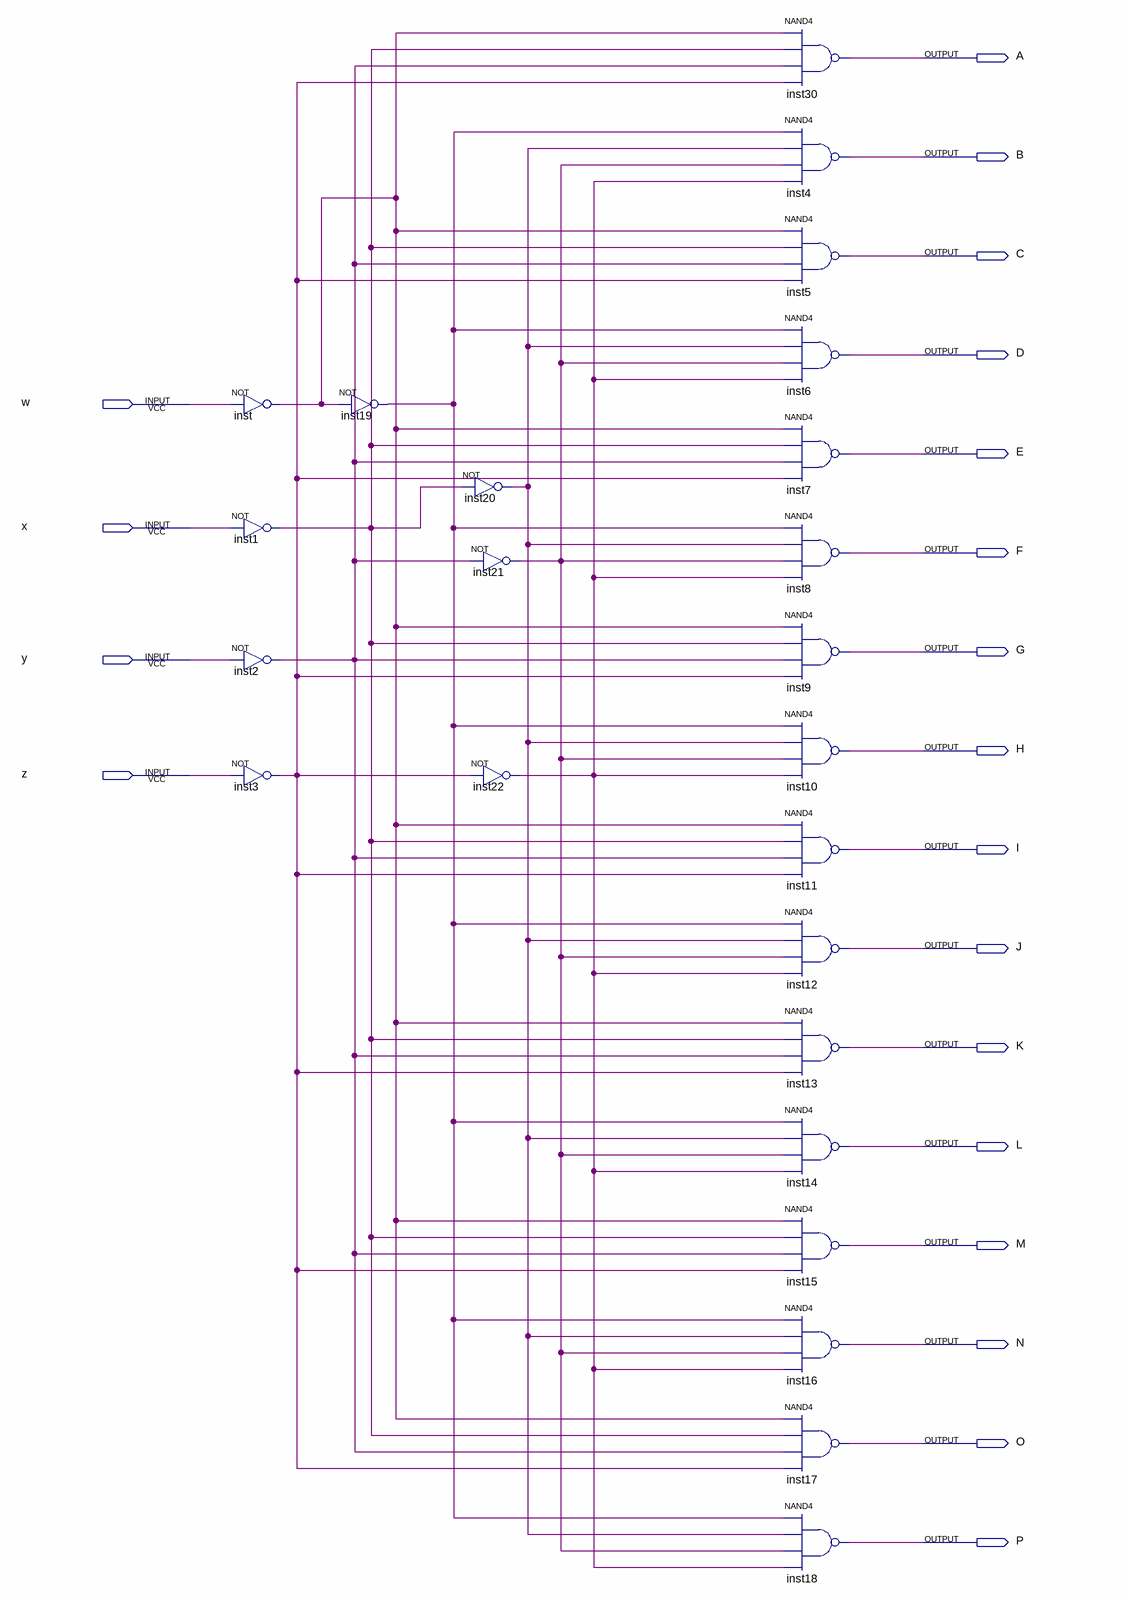
[diagram p0: schematic sheet]
// Quartus schematic decoder_circuit.bdf as structural Verilog: 24 symbols, 20 pins
module decoder_circuit (
  input  w,
  input  x,
  input  y,
  input  z,
  output A,
  output B,
  output C,
  output D,
  output E,
  output F,
  output G,
  output H,
  output I,
  output J,
  output K,
  output L,
  output M,
  output N,
  output O,
  output P
);

  wire inst1_out, inst2_out, inst3_out, inst19_out, inst20_out, inst21_out, inst22_out, inst_out;

  not inst (inst_out, w);
  not inst1 (inst1_out, x);
  not inst2 (inst2_out, y);
  not inst3 (inst3_out, z);
  not inst19 (inst19_out, inst_out);
  not inst20 (inst20_out, inst1_out);
  not inst21 (inst21_out, inst2_out);
  not inst22 (inst22_out, inst3_out);
  nand inst30 (A, inst_out, inst1_out, inst2_out, inst3_out);
  nand inst4 (B, inst19_out, inst20_out, inst21_out, inst22_out);
  nand inst5 (C, inst_out, inst1_out, inst2_out, inst3_out);
  nand inst6 (D, inst19_out, inst20_out, inst21_out, inst22_out);
  nand inst7 (E, inst_out, inst1_out, inst2_out, inst3_out);
  nand inst8 (F, inst19_out, inst20_out, inst21_out, inst22_out);
  nand inst9 (G, inst_out, inst1_out, inst2_out, inst3_out);
  nand inst10 (H, inst19_out, inst20_out, inst21_out, inst22_out);
  nand inst11 (I, inst_out, inst1_out, inst2_out, inst3_out);
  nand inst12 (J, inst19_out, inst20_out, inst21_out, inst22_out);
  nand inst13 (K, inst_out, inst1_out, inst2_out, inst3_out);
  nand inst14 (L, inst19_out, inst20_out, inst21_out, inst22_out);
  nand inst15 (M, inst_out, inst1_out, inst2_out, inst3_out);
  nand inst16 (N, inst19_out, inst20_out, inst21_out, inst22_out);
  nand inst17 (O, inst_out, inst1_out, inst2_out, inst3_out);
  nand inst18 (P, inst19_out, inst20_out, inst21_out, inst22_out);
endmodule
